# EAGLE schematic Motherboard Buck converter v5 (EAGLE 9.7.0)

## Sheet 1 of 2
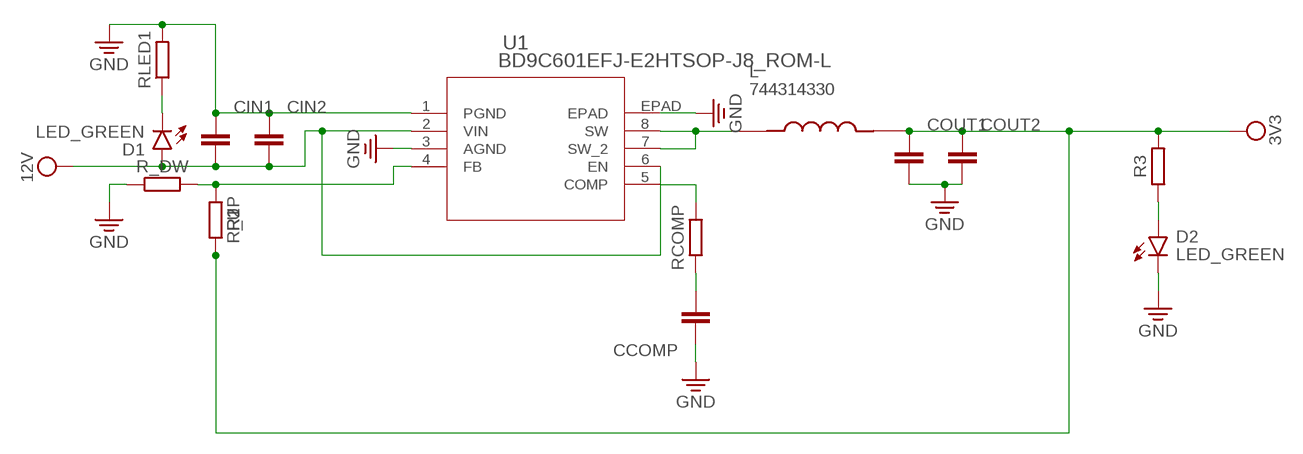
[diagram p0: schematic, sheet 1]

### Parts
CCOMP  C_CHIP-1206(3216-METRIC)  [CAPC3216X135]
CIN1  C_CHIP-1210(3225-METRIC)  [CAPC3225X135]
CIN2  C_CHIP-1206(3216-METRIC)  [CAPC3216X135]
COUT1  C_CHIP-1206(3216-METRIC)  [CAPC3216X135]
COUT2  C_CHIP-1206(3216-METRIC)  [CAPC3216X135]
D1  LED_GREEN  CHIP-FLAT-G_0805  [LEDC2012X110N_FLAT-G]
D2  LED_GREEN  CHIP-FLAT-G_0805  [LEDC2012X110N_FLAT-G]
L  744314330  [IND_744314330]
R1  R_CHIP-0603(1608-METRIC)  [RESC1608X60]
R2  R_CHIP-0603(1608-METRIC)  [RESC1608X60]
R3  R_CHIP-1206(3216-METRIC)  [RESC3216X70]
R_DW  R_CHIP-1206(3216-METRIC)  [RESC3216X70]
R_UP  R_CHIP-0603(1608-METRIC)  [RESC1608X60]
RCOMP  R_CHIP-1206(3216-METRIC)  [RESC3216X70]
RLED1  R_CHIP-1206(3216-METRIC)  [RESC3216X70]
U1  BD9C601EFJ-E2HTSOP-J8_ROM-L  [HTSOP-J8_ROM-L]

### Nets
3V3: COUT1.1 COUT2.1 L.2 R1.2 R2.2 R3.2 R_UP.2
12V: CIN1.2 CIN2.2 D1.A U1.2(VIN) U1.6(EN)
GND: CCOMP.1 CIN1.1 CIN2.1 COUT1.2 COUT2.2 D2.C R_DW.1 RLED1.2 U1.1(PGND) U1.3(AGND) U1.EPAD
N$1: R1.1 R2.1 R_DW.2 R_UP.1 U1.4(FB)
N$3: L.1 U1.7(SW_2) U1.8(SW)
N$5: D2.A R3.1
N$6: RCOMP.2 U1.5(COMP)
N$7: CCOMP.2 RCOMP.1
N$9: D1.C RLED1.1

## Sheet 2 of 2

## Library data of the parts
CCOMP CIN1 CIN2 COUT1 COUT2 = Capacitor:C: Capacitor - Generic; CATEGORY: Capacitor
D1 D2 = LED:CHIP-FLAT-G; CATEGORY: LED; COLOR: GREEN; DESCRIPTION: CHIP LED FLAT; SUB-CATEGORY: CHIP; TYPE: FLAT_TOP
L = 744314330:744314330: Inductor SMD 7050 3.3 µH 9 A Wuerth Elektronik WE-HCI 744314330 1 pc(s); MANUFACTURER: WURTH ELEKTRONIK; PARTREV: 3.5; STANDARD: Manufacturer Recommendations
R1-R3 R_DW R_UP RCOMP RLED1 = Resistor:R: Resistor Fixed - Generic; CATEGORY: Resistor; SUB-CATEGORY: Fixed
U1 = BD9C601EFJ-E2:BD9C601EFJ-E2; COPYRIGHT: Copyright (C) 2021 Ultra Librarian. All rights reserved.; DIGI-KEY_PART_NUMBER_1: 846-1115-2-ND; DIGI-KEY_PART_NUMBER_2: 846-1115-1-ND; DIGI-KEY_PART_NUMBER_3: 846-1115-6-ND; MANUFACTURER_PART_NUMBER: BD9C601EFJ-E2; MFR_NAME: ROHM Semiconductor